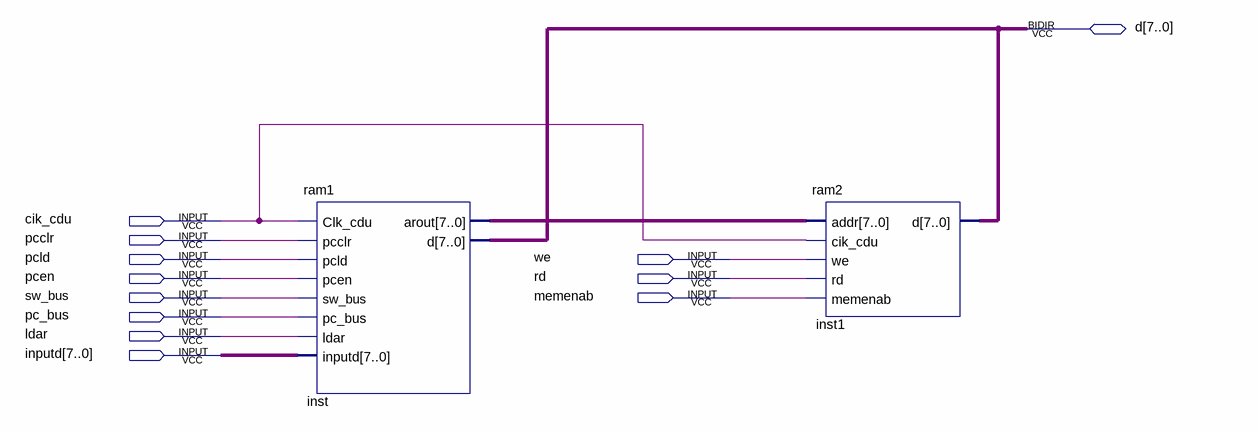
[diagram p0: schematic sheet]
// Quartus schematic ram.bdf as structural Verilog: 2 symbols, 12 pins
module ram (
  input  cik_cdu,
  input  pcclr,
  input  pcld,
  input  we,
  input  pcen,
  input  rd,
  input  sw_bus,
  input  memenab,
  input  pc_bus,
  input  ldar,
  input  [7:0] inputd,
  inout  [7:0] d
);

  wire [7:0] inst_arout;

  ram1 inst (
    .Clk_cdu(cik_cdu), .pcclr(pcclr), .pcld(pcld), .pcen(pcen), .sw_bus(sw_bus), .pc_bus(pc_bus),
    .ldar(ldar), .inputd(inputd), .arout(inst_arout), .d(d));
  ram2 inst1 (.addr(inst_arout), .cik_cdu(cik_cdu), .we(we), .rd(rd), .memenab(memenab), .d(d));
endmodule
